# EAGLE design CV_Switch (EAGLE 7.6.0)
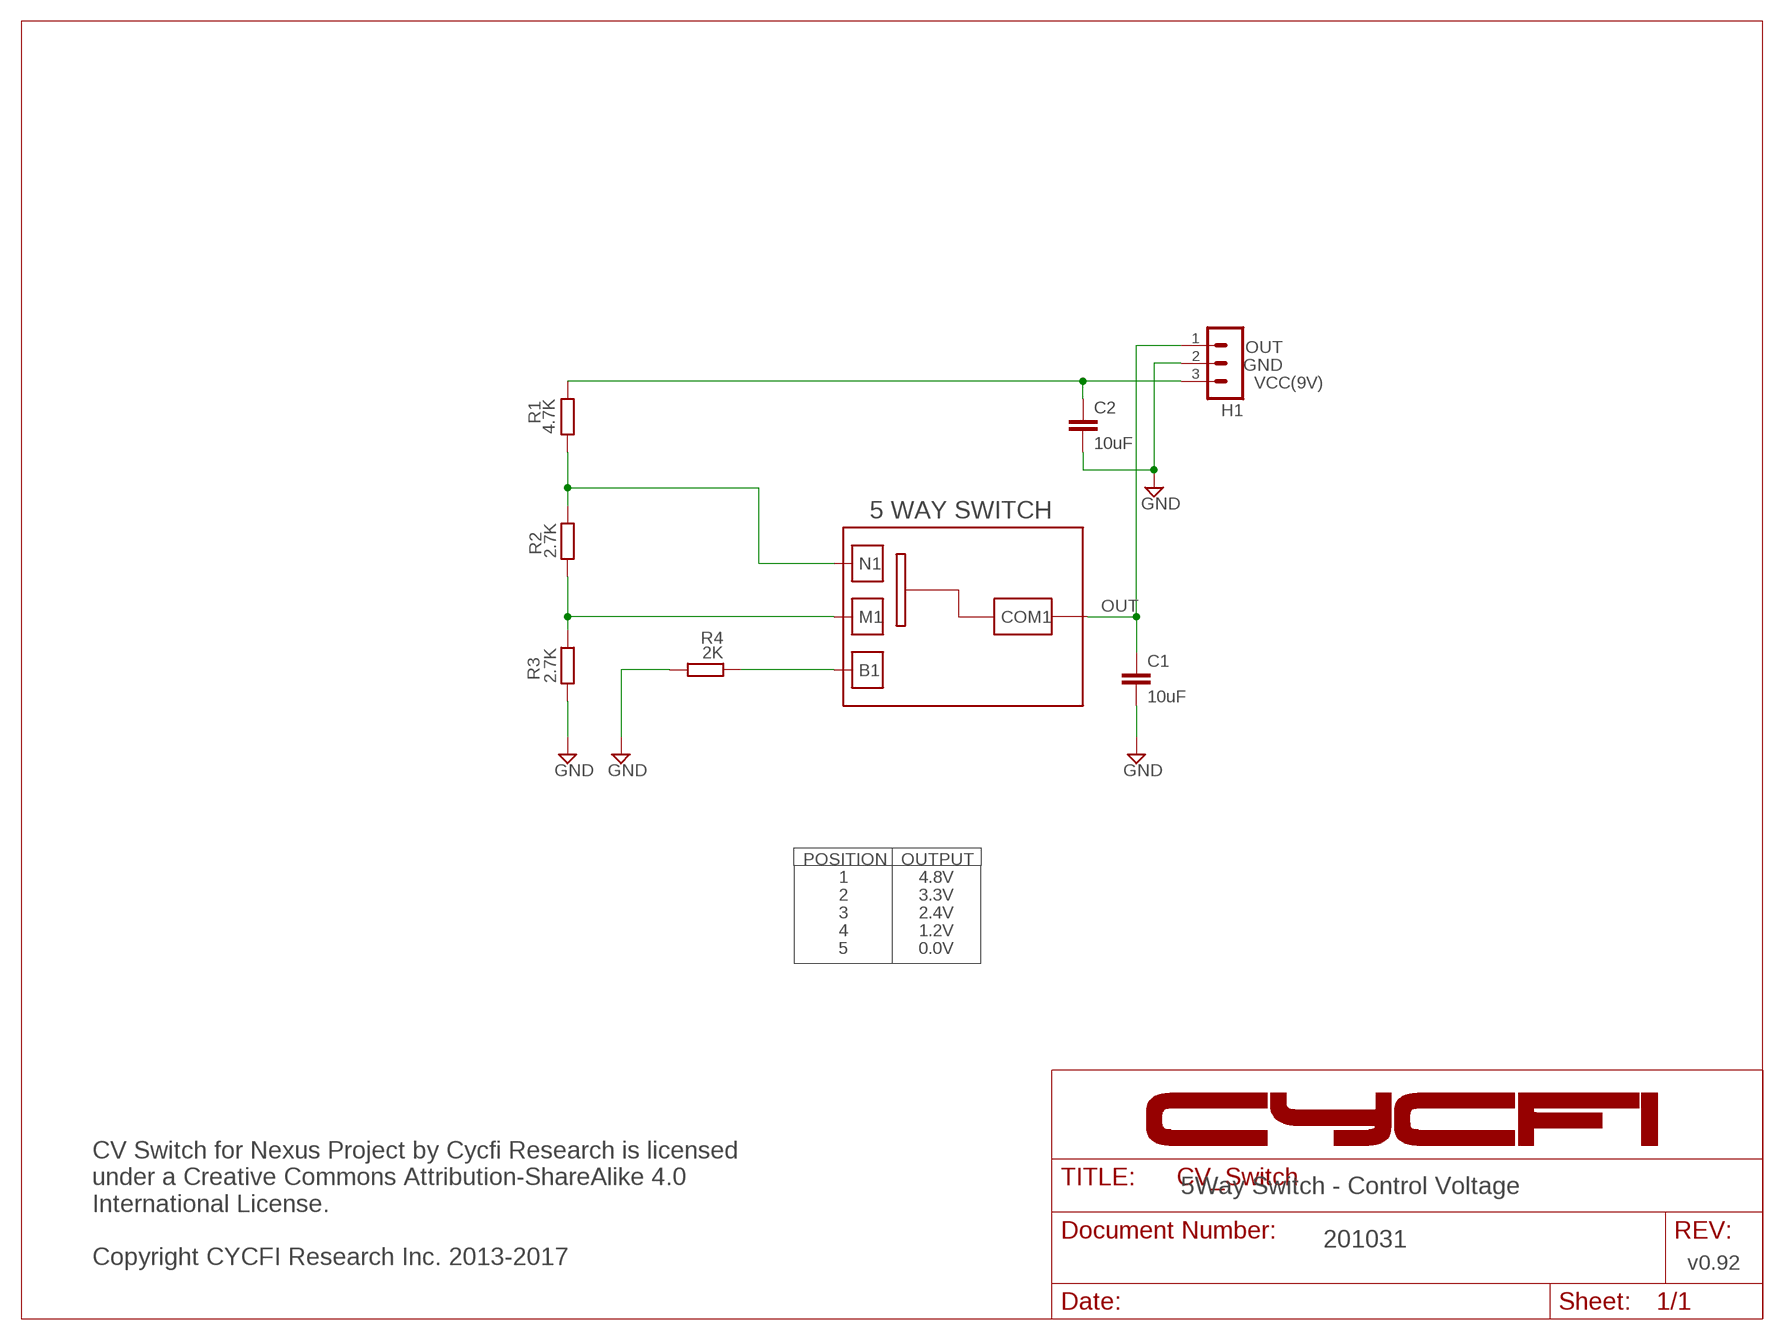
[diagram p0: schematic, sheet 1]

## Parts
C1  10uF  C-EUC0805  [C0805]
C2  10uF  C-EUC0805  [C0805]
H1  MA03-1_EDITED  [MA03-1_]
R1  4.7K  R-EU_R0402  [R0402]
R2  2.7K  R-EU_R0402  [R0402]
R3  2.7K  R-EU_R0402  [R0402]
R4  2K  R-EU_R0402  [R0402]
U$1  5WAY_SW_1  [5WAY_SW_CASTELLATED]

## Nets
GND: C1.2 C2.2 H1.2 R3.1 R4.1
N$1: C2.1 H1.3 R1.2
N$2: R1.1 R2.2 U$1.N1
N$3: R4.2 U$1.B1
N$6: R2.1 R3.2 U$1.M1
OUT: C1.1 H1.1 U$1.COM1

## Notes on the sheet
- OUT
- GND
- VCC(9V)
- POSITION | OUTPUT
- 1 | 4.8V
- 2 | 3.3V
- 3 | 2.4V
- 4 | 1.2V
- 5 | 0.0V
- 5Way Switch - Control Voltage
- 201031
- CV Switch for Nexus Project by Cycfi Research is licensed 
  under a Creative Commons Attribution-ShareAlike 4.0 
  International License. 
  
  Copyright CYCFI Research Inc. 2013-2017
- v0.92

## Library data of the parts
C1 C2 = resistor:C-EU: CAPACITOR, European symbol
H1 = con-lstb:MA03-1: PIN HEADER
R1-R4 = resistor:R-EU_: RESISTOR, European symbol
U$1 = CYCFI_switch:5WAY_SW_1

## Board
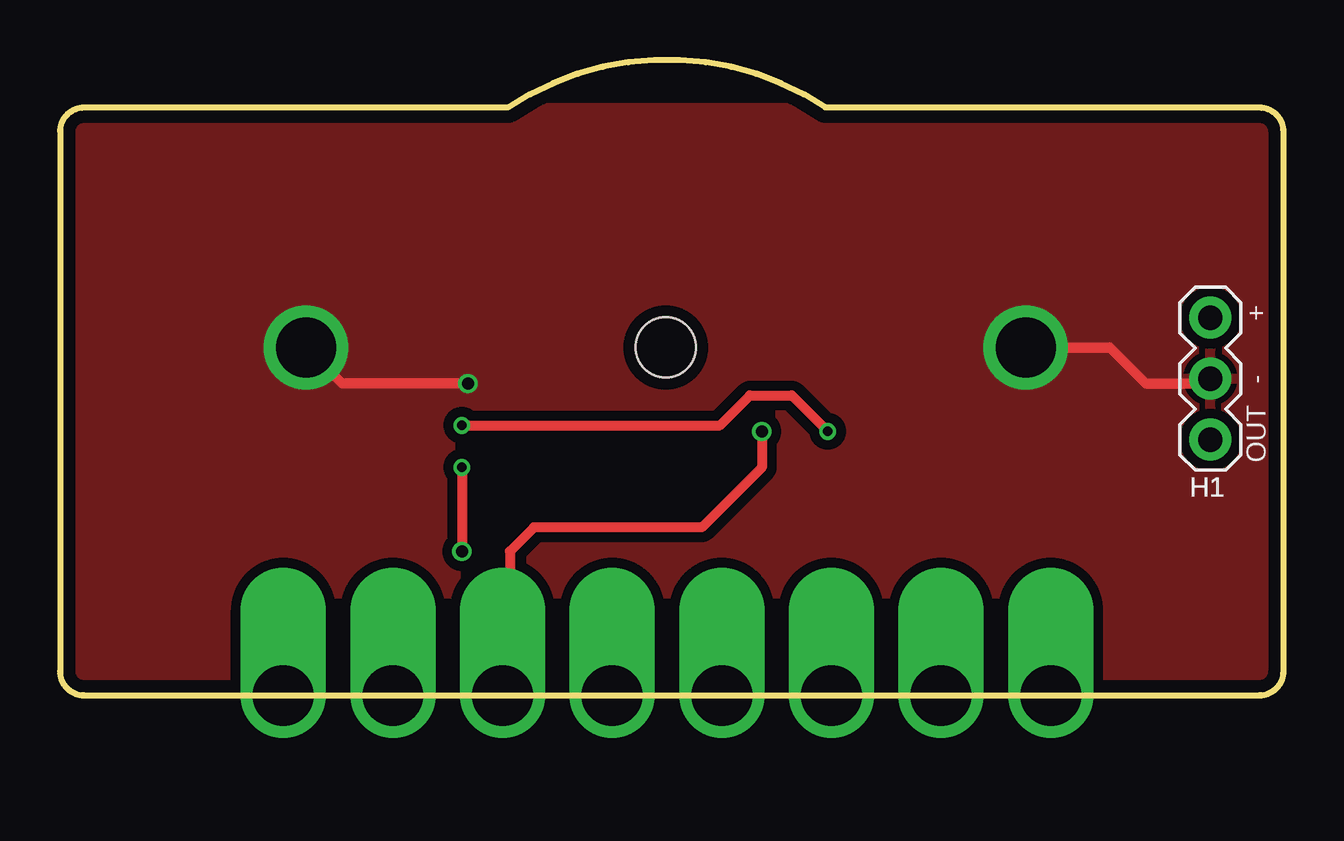
[diagram p1: board, top side]
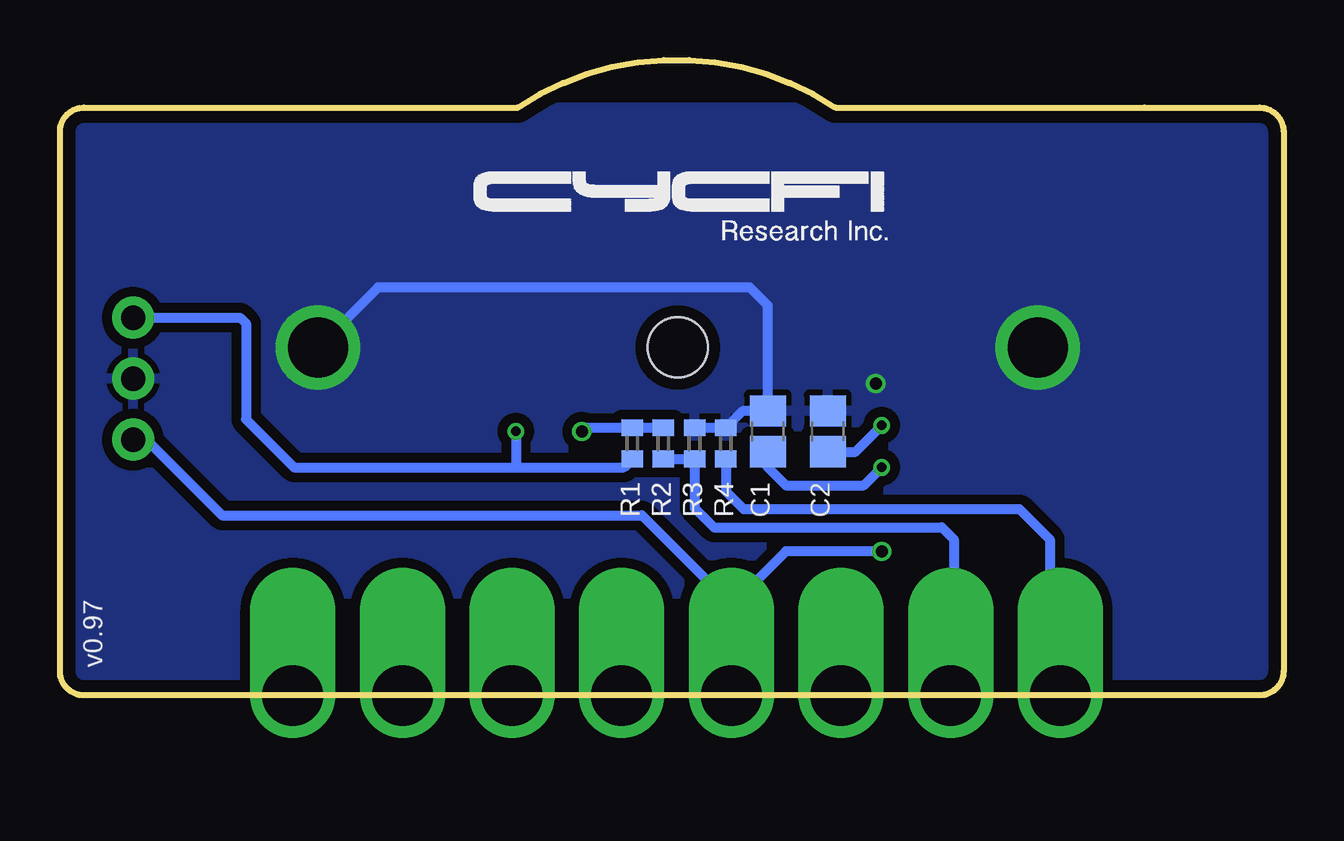
[diagram p2: board, bottom side, seen from below]

Size 51 x 26.49 mm. Coordinates in mm from the lower left corner, seen from the top.
Outline: 5.8,24.5 18.67,24.5 arc-67 31.94,24.5 44.8,24.5
Outline: 31.9,24.5 50,24.5 arc-90 51,23.5 51,1 arc-90 50,0 1,0 arc-90 0,1 0,23.5 arc-90 1,24.5 5.8,24.5
Copper layers (1*16): Top 0.035mm / dielectric 1.6mm / Bottom 0.035mm
Design rules "Elecrow_2-layer_PCB_eagle_rule": minimum track width 6mil, minimum drill 12mil, track to track 6mil, track to pad 8mil, pad to pad 12mil, via to via 12mil, smd to smd 0mil, copper to edge 20mil, drill to drill 10mil, minimum pad ring 6mil, minimum via ring 6mil, stop-mask expansion 0mil, vias tented up to drill 100mil, thermal gap 10mil
Holes 2.5 mm at 25.25,14.5

### Footprints (pad centres in the part's own frame; a part is rotated, then mirrored left to right if it is on the bottom)
C0805 = smd 1.3 x 1.5: 1 -0.85,0; 2 0.85,0
MA03-1_ = drill 1.016 pad 1.75: 1 -2.54,0; 2 0,0; 3 2.54,0
R0402 = smd 0.7 x 0.9: 1 -0.65,0; 2 0.65,0
5WAY_SW_CASTELLATED = drill 2.54 offset: B1 -15.995,0; B2 6.855,0; COM1 -2.285,0; COM2 2.285,0; M1 -11.425,0; M2 11.425,0; N1 -6.855,0; N2 15.995,0

### Placement (x,y rotation side)
C1  21.5,11 90 bottom
C2  19,11 90 bottom
H1  47.95,13.2 90 top
R1  27.15,10.5 270 bottom
R2  25.85,10.5 90 bottom
R3  24.55,10.5 270 bottom
R4  23.25,10.5 270 bottom
U$1  25.3,-0.01 0 top

### Tracks (layer width: path | path; a pad name or v marks a point on that pad's centre or on a via)
GND  (via drill 0.5, 2.5)
  Top 0.406: v17,13 11.75,13 v10.25,14.5 | v40.25,14.5 43.75,14.5 45.25,13 47.75,13 H1.2
  Bottom 0.406: 21.4,11.75 C1.2 | C1.2 21.5,16.25 22.25,17 37.75,17 v40.25,14.5 | C1.2 22.55,11.85 R4.1 R3.1
  pour Top (isolate 0.406): -0.25,24.5 51.25,24.5 51.25,0 -0.25,0
  pour Bottom (isolate 0.406): -0.25,24.5 51.25,24.5 51.25,0 -0.25,0
N$1  (via drill 0.4)
  Top 0.406: v16.75,11.25 27.5,11.25 28.75,12.5 30.5,12.5 v32,11
  Bottom 0.406: H1.3 43.49,15.74 43.25,15.5 43.25,11.5 41.25,9.5 32,9.5 | 32,9.5 27.5,9.5 R1.2 | C2.1 17.85,10.15 v16.75,11.25 | v32,11 32,9.5
N$2  (via drill 0.5)
  Top 0.406: v29.25,11 29.25,9.5 26.75,7 19.75,7 18.75,6 18.75,0.29 U$1.N1
  Bottom 0.406: R1.1 R2.2 29.1,11.15 v29.25,11
N$3
  Bottom 0.406: R4.2 23.25,8.5 22.5,7.75 11,7.75 9.75,6.5 9.75,0.43 U$1.B1
N$6
  Bottom 0.406: R2.1 R3.2 24.55,7.8 23.75,7 14.25,7 13.75,6.5 13.75,0.11 U$1.M1
OUT  (via drill 0.4, 0.5)
  Top 0.406: v16.75,9.5 v16.75,6
  Bottom 0.406: H1.1 47.41,10.66 44.25,7.5 26.75,7.5 23,3.75 | 23,3.75 22.75,3.5 22.75,0.25 U$1.COM1 | v16.75,6 20.75,6 23,3.75 | C1.1 21.5,9.5 20.75,8.75 17.5,8.75 v16.75,9.5

### Text on the board
tNames: + | - | H1 | H1 | H1 | H1 | OUT
bNames: C1 | R4 | R4 | R3 | R3 | R2 | R2 | R1 | R1 | v0.97